# Altium schematic sheet PA_Channel_SUP_CTRL.SchDoc
size A4
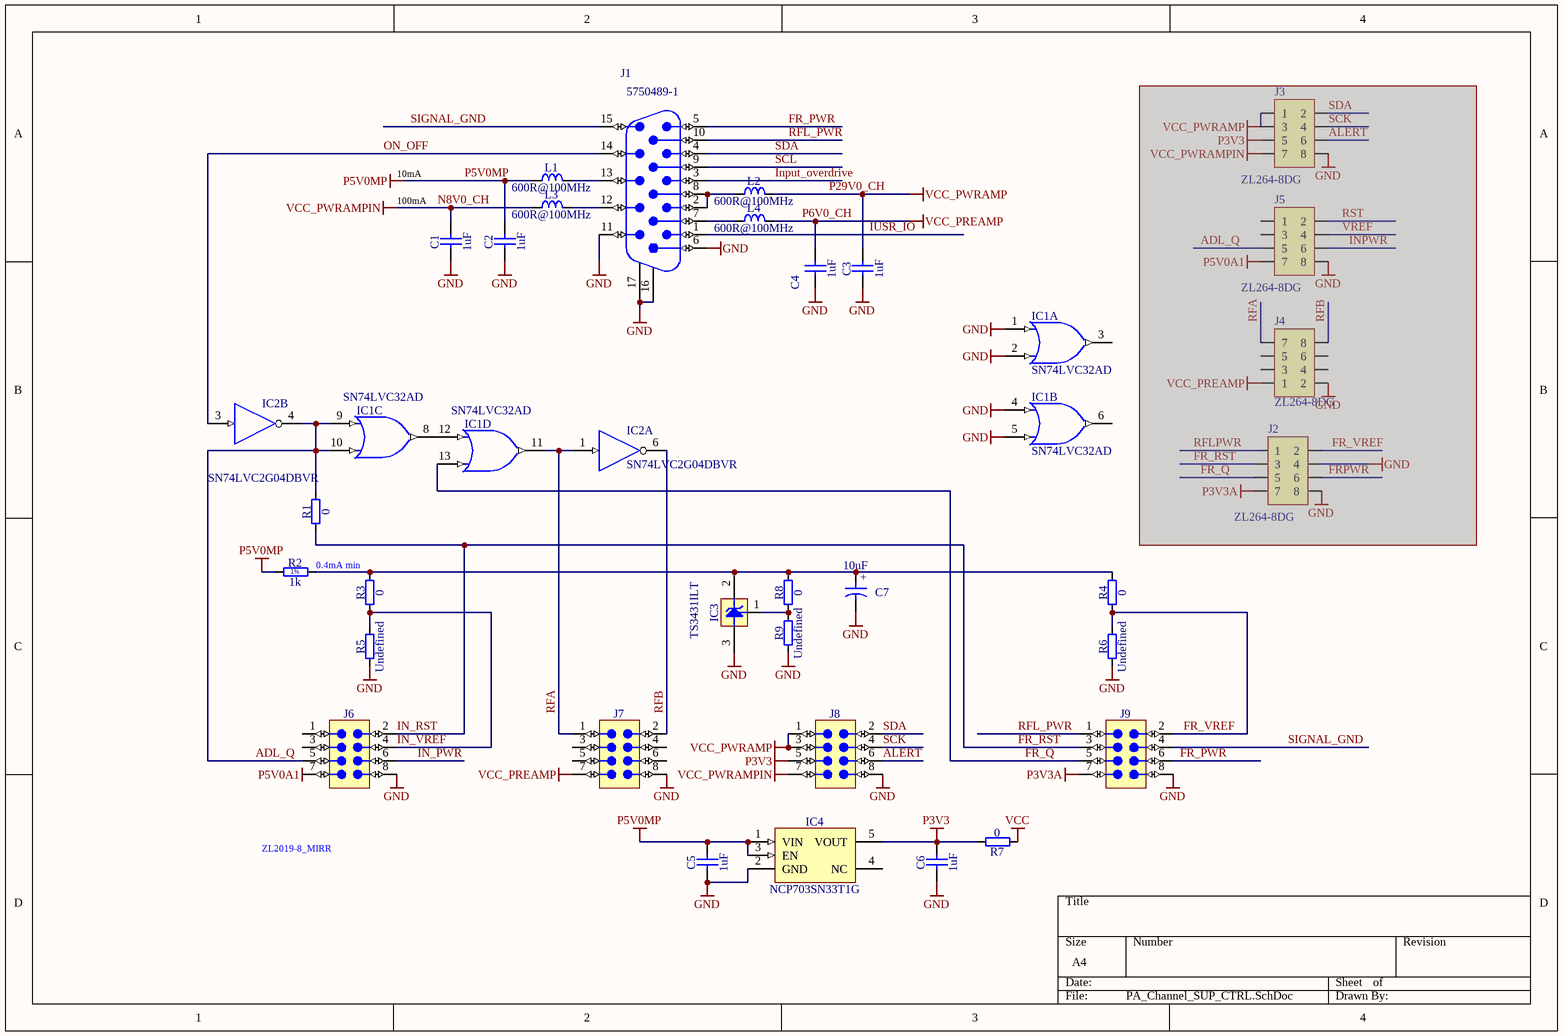
[diagram p0: PA_Channel_SUP_CTRL.SchDoc]

## Parts
C1  1uF  [CAPC2012X110N]
C2  1uF  [CAPC2012X110N]
C3  1uF  [CAPC2012X110N]
C4  1uF  [CAPC2012X110N]
C5  1uF  [CAPC2012X140N]
C6  1uF  [CAPC2012X140N]
C7  10uF  [CAPMP3216X180N]
IC1  SN74LVC32AD  [SOIC127P600X175-14N]  (parts A,B,C,D of 4)
IC2  SN74LVC2G04DBVR  [SOT95P280X145-6N]  (parts A,B of 2)
IC3  TS3431ILT  [SOT95P237X112-3N]
IC4  NCP703SN33T1G  [SOT95P275X110-5N]
J1  Manufacturer Part Number: 5750489-1  [TYCO_5750489-1]  (hidden comment: HD-Sub)
J2  ZL264-8DG  [ZL264-8DG]  (masked out: inside a compile mask, not in the netlist)
J3  ZL264-8DG  [ZL264-8DG]  (masked out: inside a compile mask, not in the netlist)
J4  ZL264-8DG  [ZL264-8DG]  (masked out: inside a compile mask, not in the netlist)
J5  ZL264-8DG  [ZL264-8DG]  (masked out: inside a compile mask, not in the netlist)
J6  Header 8  [ZL2019-8_MIRR]  (value not drawn)
J7  Header 8  [ZL2019-8_MIRR]  (value not drawn)
J8  Header 8  [ZL2019-8_MIRR]  (value not drawn)
J9  Header 8  [ZL2019-8_MIRR]  (value not drawn)
L1  600R@100MHz  [INDC3216X130N]
L2  600R@100MHz  [INDC3216X130N]
L3  600R@100MHz  [INDC3216X130N]
L4  600R@100MHz  [INDC3216X130N]
R1  0  [RESC1608X55N]
R2  1k  [RESC1608X55N]
R3  0  [RESC1608X55N]
R4  0  [RESC1608X55N]
R5  Undefined  [RESC1608X55N]
R6  Undefined  [RESC1608X55N]
R7  0  [RESC1608X55N]
R8  0  [RESC1608X55N]
R9  Undefined  [RESC1608X55N]

## Nets
GND: C1.1 C2.1 C3.1 C4.1 C5.1 C6.1 C7.2 IC1.1(A) IC1.2(B) IC1.4(A) IC1.5(B) IC1.7(GND) IC2.2(GND) IC3.3(A) IC4.2(GND) J1.6 J1.11 J1.16 J1.17 J6.8 J7.8 J8.8 J9.8 R5.1 R6.1 R9.1
N8V0_CH: C1.2 J8.7 L3.1  [also labelled VCC_PWRAMPIN]
P3V3: C6.2 IC4.5(VOUT) J8.5 R7.2
P3V3A: J9.7
P5V0MP: C2.2 C5.2 IC4.1(VIN) IC4.3(EN) L1.1 R2.1
P6V0_CH: C4.2 J7.7 L4.2  [also labelled VCC_PREAMP]
P29V0_CH: C3.2 J8.1 J8.3 L2.2  [also labelled VCC_PWRAMP]
VCC: IC1.14(VCC) IC2.5(VCC) R7.1
ADL_Q: IC1.9(A) IC1.10(B) IC2.4(OUT) J6.5 R1.2
ALERT: J8.6
FR_PWR: J1.5 J9.6
FR_Q: IC1.13(B) J9.5
FR_RST: J6.2 J9.3 R1.1  [also labelled IN_RST]
FR_VREF: J9.2 R4.1 R6.2
IN_PWR: J6.6
IN_VREF: J6.4 R3.1 R5.2
Input_overdrive: J1.3
IUSR_IO: J1.1
ON_OFF: IC2.3(IN) J1.14
RFA: IC1.11(Y) IC2.1(IN) J7.1
RFB: IC2.6(OUT) J7.2
RFL_PWR: J1.10 J9.1
SCK: J8.4
SCL: J1.9
SDA: J1.4 J8.2
SIGNAL_GND: J1.15 J9.4
NetC7_1: C7.1 IC3.2(C) R2.2 R3.2 R4.2 R8.2
NetIC1_8: IC1.8(Y) IC1.12(A)
NetIC3_1: IC3.1(Adj) R8.1 R9.2
NetJ1_2: J1.2 J1.8 L2.1
NetJ1_7: J1.7 L4.1
NetJ1_12: J1.12 L3.2
NetJ1_13: J1.13 L1.2

Not connected (* = marked no-connect by the designer): IC1 3(Y) 6(Y); IC4 4(NC); J6 1 3 7; J7 3 4 5 6

## Notes on the sheet
- 10mA
- (near C1) 100mA
- 0.4mA min
- ZL2019-8_MIRR
- Labels drawn without touching a wire or pin: P5V0A1
- (in symbol CTE3216-18_10UF_16V_20%_AVX_TCJ) +
- (in symbol R0603_1K_1%_0.1W_100PPM) 1%

## Library data of the parts
C1-C4 = CC0805_1UF_50V_10%_X7R: Non-polarised capacitor; Part Description: SMD Multilayer Chip Ceramic Capacitor; Manufacturer: GENERIC; Manufacturer1 Part Number: C0805C105K5RACTU; Voltage: 50V; TC: X7R; Tolerance: ±10%; Part Number: CC0805_1UF_50V_10%_X7R; Component Kind: Standard; Component Type: Standard; Pin Count: 2; Value: 1uF; Status: Preferred; Manufacturer Part Number: CC0805_1UF_50V_10%_X7R; Case: 0805; Mounted: Yes; Socket: No; SMD: Yes; Sense: No; Manufacturer1 Example: KEMET; Manufacturer1 ComponentHeight: 1.1mm; HelpURL: \\cern.ch\dfs\Applications\Altium\Datasheets\CC0805_X7R_KEMET.pdf; Author: CERN DEM JLC; CreateDate: 04.12.2013; LatestRevisionDate: 04.12.2013
C5 C6 = CC0805_1UF_35V_20%_X7R: Non-polarised capacitor; Part Description: SMD Multilayer Chip Ceramic Capacitor; Manufacturer: GENERIC; Manufacturer1 Part Number: GMK212B7105MG-T; Voltage: 35V; TC: X7R; Tolerance: ±20%; Part Number: CC0805_1UF_35V_20%_X7R; Component Kind: Standard; Component Type: Standard; Pin Count: 2; Value: 1uF; Status: Not Recommended; Manufacturer Part Number: CC0805_1UF_35V_20%_X7R; Case: 0805; Mounted: Yes; Socket: No; SMD: Yes; Sense: No; Manufacturer1 Example: TAIYO YUDEN; Manufacturer1 ComponentHeight: 1.35mm; HelpURL: \\cern.ch\dfs\Applications\Altium\Datasheets\CC0805_X7R_TAIYO-YUDEN_HIGH-VALUE.pdf; Author: CERN DEM JLC; CreateDate: 22.06.2011; LatestRevisionDate: 22.06.2011
C7 = CTE3216-18_10UF_16V_20%_AVX_TCJ: Polarised capacitor; Part Description: ESR 0R200 Tantalum Solid Electrolytic Chip Capacitor with Conductive Polymer Electrode; Manufacturer: AVX; Manufacturer Part Number: TCJA106M016R0200; Voltage: 16V; Tolerance: ±20%; Part Number: CTE3216-18_10UF_16V_20%_AVX_TCJ; Component Kind: Standard; Component Type: Standard; Pin Count: 2; Value: 10uF; Status: Preferred; Case: A; Mounted: Yes; Socket: No; SMD: Yes; Sense: No; ComponentHeight: 1.8mm; HelpURL: \\cern.ch\dfs\Applications\Altium\Datasheets\CTE_AVX_TCJ.pdf; Author: CERN DEM JLC; CreateDate: 29.03.2012; LatestRevisionDate: 29.03.2012
IC1 = SN74LVC32AD: Quad 2-Input OR Gate; Part Description: Quad 2-Input Positive-OR Gate; Manufacturer: TEXAS INSTRUMENTS; PressFit: No; Bonding: No; Part Number: SN74LVC32AD; Component Kind: Standard; Component Type: Standard; Device: SN74LVC32AD; PackageDescription: SOIC 14, Pitch 1.27mm - Body 4x8.75mm, IPC Medium Density; Manufacturer Part Number: SN74LVC32AD; Pin Count: 14; Case: SOIC14; Mounted: Yes; Socket: No; SMD: Yes; Sense: No; ComponentHeight: 1.75mm; Author: CERN DEM JLC; HelpURL: \\cern.ch\dfs\Applications\Altium\Datasheets\SN74LVC32AD.pdf; CreateDate: 21.03.2012; LatestRevisionDate: 21.03.2012
IC2 = SN74LVC2G04DBVR: Dual Inverter Buffer; Part Description: Dual Inverter Gate; Manufacturer: TEXAS INSTRUMENTS; PressFit: No; Bonding: No; Part Number: SN74LVC2G04DBVR; Component Kind: Standard; Component Type: Standard; Device: SN74LVC2G04DBVR; PackageDescription: SOT23, 6-Leads, Body 1.6x3.0mm, Pitch 0.95mm, IPC Medium Density; Manufacturer Part Number: SN74LVC2G04DBVR; Pin Count: 6; Case: SOT23-6; Mounted: Yes; Socket: No; SMD: Yes; Sense: No; ComponentHeight: 1.45mm; Author: CERN DEM JMW; HelpURL: \\cern.ch\dfs\Applications\Altium\Datasheets\SN74LVC2G04DBVR.pdf; CreateDate: 26.08.2016; LatestRevisionDate: 26.08.2016
IC3 = TS3431ILT: Precision Reference 1=Adj 2=Cathode 3=Anode; Part Description: 1.24 V Programmable Shunt Voltage Reference; Manufacturer: ST MICROELECTRONICS; PressFit: No; Bonding: No; Part Number: TS3431ILT; Component Kind: Standard; Component Type: Standard; Device: TS3431ILT; PackageDescription: SOT, 0.95mm, pitch; 3 pin,1.30mm W X 2.92mm L X 1.12mm H body, IPC Medium Density; Manufacturer Part Number: TS3431ILT; Pin Count: 3; Case: SOT23; Mounted: Yes; Socket: No; SMD: Yes; Sense: No; ComponentHeight: 1.12mm; HelpURL: \\cern.ch\dfs\Applications\Altium\Datasheets\TS3431ILT.pdf; Author: CERN DEM JLC; CreateDate: 17.11.2016; LatestRevisionDate: 17.11.2016
IC4 = NCP703SN33T1G: 3.3V 300mA, Ultra-Low Quiescent Current, IQ 12uA, Ultra-Low Noise, LDO Voltage Regulator; Manufacturer: ON SEMICONDUCTOR; PressFit: No; Bonding: No; Part Number: NCP703SN33T1G; Component Kind: Standard; Component Type: Standard; Device: NCP703SN33T1G; PackageDescription: SOT, 0.95mm Pitch; 5 Pin, 1.50mm W X 3.00mm L X 1.10mm H Body, IPC Medium Density; Part Description: 3.3V 300mA, Ultra-Low Quiescent Current, IQ 12uA, Ultra-Low Noise, LDO Voltage Regulator; Manufacturer Part Number: NCP703SN33T1G; Pin Count: 5; Case: SOT23-5; Mounted: Yes; Socket: No; SMD: Yes; Sense: No; ComponentHeight: 1.1mm; HelpURL: \\cern.ch\dfs\Applications\Altium\Datasheets\NCP703SN33T1G.pdf; Author: CERN DEM JLC; CreateDate: 16.02.2017; LatestRevisionDate: 16.02.2017
J1 = CON_DB15_V_M_5750489-1: Connector High Density D-sub 15 Male; Part Description: 15 Male Contacts, Straight High Density D-SUB Connector, AMPLIMITE HD-22 Serie; Manufacturer: TYCO ELECTRONICS; PressFit: No; Part Number: TYCO_5750489-1; Component Kind: Standard; Component Type: Standard; Pin Count: 17; Family: HD-Sub; Mounted: Yes; Socket: No; SMD: No; Sense: No; Status: None; ComponentHeight: 12.75mm; HelpURL: \\cern.ch\dfs\Applications\Altium\Datasheets\TYCO_1-1734530-1.pdf; Author: GK; CreateDate: 26.06.2013; LatestRevisionDate: 26.06.2013
J2-J5 = CON_2X4 2.54 SMT FEM: 2.54mm pitch connector
J6-J9 = CON_2x4 2.54 male MIRROR: Connector 8 Male; Part Number: ZL2019-8; Part Description: 8 Contacts, Pitch 2.54mm, Dual Row  Through Mount Straight Header (Post Lead 5.84mm, Tail Lead 2.92mm, Insulator 2.54mm); Manufacturer: NINIGI; PressFit: No; Component Kind: Standard; Component Type: Standard; Pin Count: 8; Family: Header 8; Mounted: Yes; Socket: No; Sense: No; SMD: No; Status: None; Manufacturer Part Number: ZL2019-8; ComponentHeight: 19.4; HelpURL: \\cern.ch\dfs\Applications\Altium\Datasheets\SAMTEC_TSW-104-23-L-D.pdf; Author: GK; CreateDate: 08.03.2017; LatestRevisionDate: 08.03.2017
L1-L4 = IND1206_WURTH_74279218: Inductor; Part Description: SMD EMI Suppression Chip Ferrite Bead (WE-CBF Series); Manufacturer: WURTH ELEKTRONIK; Power: 2A; Resistance: 0.1R; Tolerance: ±25%; Part Number: IND1206_WURTH_74279218; Component Kind: Standard; Component Type: Standard; Pin Count: 2; Value: 600R@100MHz; Status: None; Manufacturer Part Number: 74279218; Case: 1206; Mounted: Yes; Socket: No; SMD: Yes; Sense: No; ComponentHeight: 1.3mm; HelpURL: \\cern.ch\dfs\Applications\Altium\Datasheets\IND1206_WURTH_74279218.pdf; Author: CERN DEM JLC; CreateDate: 24.01.2012; LatestRevisionDate: 24.01.2012
R1 R3 R4 R7 R8 = R0603_0R_JUMPER: Resistor; Part Description: 1A (0.05R Max DC Resistance) Zero Ohm Jumper; Manufacturer: GENERIC; Manufacturer1 Part Number: NRC06Z0; PressFit: No; Part Number: R0603_0R_JUMPER; Component Kind: Standard; Component Type: Standard; Pin Count: 2; Value: 0; Status: Preferred; Manufacturer Part Number: R0603_0R_JUMPER; Case: 0603; Mounted: Yes; Sense: No; Socket: No; SMD: Yes; Manufacturer1 Example: NIC COMPONENT; Manufacturer1 ComponentHeight: 0.55mm; HelpURL: \\cern.ch\dfs\Applications\Altium\Datasheets\R0603_NIC_NRC.pdf; Author: CERN DEM JLC; CreateDate: 03.12.2007; LatestRevisionDate: 13.03.2008
R2 = R0603_1K_1%_0.1W_100PPM: Resistor - 1%; Part Description: General Purpose Thick Film Chip Resistor; Manufacturer: GENERIC; Manufacturer1 Part Number: NRC06F1001TRF; Power: 0.1W; TC: ±100ppm/°C; PressFit: No; Part Number: R0603_1K_1%_0.1W_100PPM; Component Kind: Standard; Component Type: Standard; Pin Count: 2; Value: 1k; Status: Preferred; Tolerance: ±1%; Manufacturer Part Number: R0603_1K_1%_0.1W_100PPM; Case: 0603; Mounted: Yes; Sense: No; Socket: No; SMD: Yes; Manufacturer1 Example: NIC COMPONENT; Manufacturer1 ComponentHeight: 0.55mm; HelpURL: \\cern.ch\dfs\Applications\Altium\Datasheets\R0603_NIC_NRC.pdf; Author: CERN DEM JLC; CreateDate: 03.12.2007; LatestRevisionDate: 13.03.2008
R5 R6 R9 = R0603_NO-VALUE: Resistor; Part Description: Reserved Footprint For a 0603 (1608) Chip Resistor; PressFit: No; Mounted: No; Part Number: R0603_NO-VALUE; Component Kind: Standard; Component Type: Standard; Pin Count: 2; Value: Undefined; Status: None; Manufacturer: Undefined; Manufacturer Part Number: R0603_NO-VALUE; Case: 0603; Sense: No; Socket: No; SMD: Yes; Manufacturer1 Example: Undefined; Manufacturer1 Part Number: Undefined; Manufacturer1 ComponentHeight: Undefined; HelpURL: Undefined; Author: CERN DEM JLC; CreateDate: 03.12.2007; LatestRevisionDate: 13.03.2008